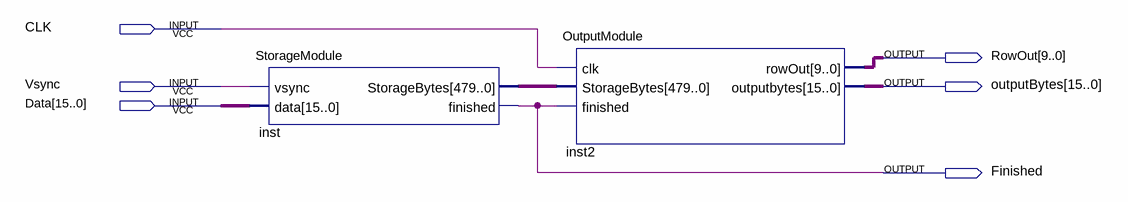
[diagram p0: schematic sheet]
// Quartus schematic StorageBytes2.bdf as structural Verilog: 2 symbols, 6 pins
module StorageBytes2 (
  input  CLK,
  input  Vsync,
  input  [15:0] Data,
  output [9:0] RowOut,
  output [15:0] outputBytes,
  output Finished
);

  wire [479:0] inst_storagebytes;

  StorageModule inst (.vsync(Vsync), .data(Data), .StorageBytes(inst_storagebytes), .finished(Finished));
  OutputModule inst2 (
    .clk(CLK), .StorageBytes(inst_storagebytes), .finished(Finished), .rowOut(RowOut),
    .outputbytes(outputBytes));
endmodule
